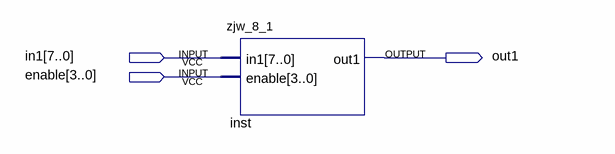
[diagram p0: schematic sheet]
// Quartus schematic Block1.bdf as structural Verilog: 1 symbols, 3 pins
module Block1 (
  input  [7:0] in1,
  input  [3:0] enable,
  output out1
);

  zjw_8_1 inst (.in1(in1), .enable(enable), .out1(out1));
endmodule
